# EAGLE design stlink_mount (EAGLE 8.5.0)
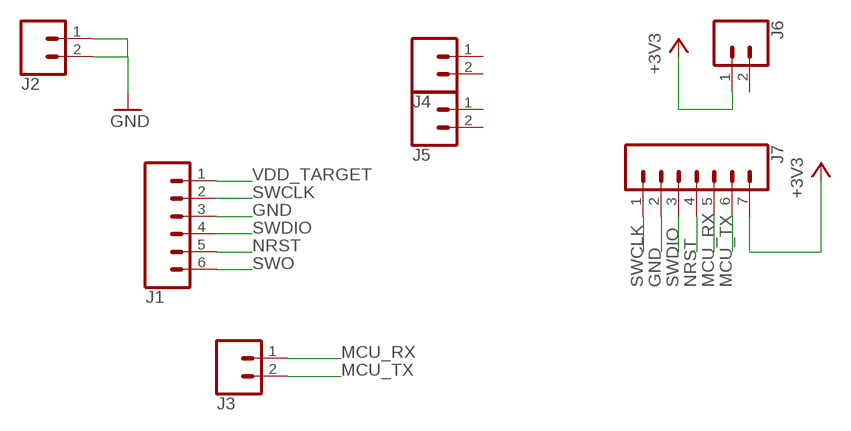
[diagram p0: schematic, sheet 1]

## Parts
J1  CONN_06SILK_FEMALE_PTH  [1X06]
J2  CONN_02  [1X02]
J3  CONN_02  [1X02]
J4  CONN_02  [1X02]
J5  CONN_02  [1X02]
J6  CONN_02  [1X02]
J7  CONN_07  [1X07]

## Nets
+3V3: J6.1 J7.7
GND: J1.3 J2.1 J2.2 J7.2
MCU_RX: J3.1 J7.5
MCU_TX: J3.2 J7.6
NRST: J1.5 J7.4
SWCLK: J1.2 J7.1
SWDIO: J1.4 J7.3
SWO: J1.6
VDD_TARGET: J1.1
Unconnected: J4.1 J4.2 J5.1 J5.2 J6.2

## Library data of the parts
J1 = SparkFun-Connectors:CONN_06: Multi connection point. Often used as Generic Header-pin footprint for 0.1 inch spaced/style header connections On any of the 0.1 inch spaced packages, you can populate with these: Break Away Headers - Straight <https://www.sparkfun.com/products/116> (PRT-00116) Break Away Male Headers - Right Angle <https://www.sparkfun.com/products/553> (PRT-00553) Female Headers <https://www.sparkfun.com/products/115> (PRT-00115) Break Away Headers - Machine Pin <https://www.sparkfun.com/products/117> (PRT-00117) Break Away Female Headers - Swiss Machine Pin <https://www.sparkfun.com/products/743> (PRT-00743) Arduino Stackable Header - 6 Pin <https://www.sparkfun.com/products/9280> (PRT-09280) For SCREWTERMINALS and SPRING TERMINALS visit here: Screw Terimnals on SparkFun.com <https://www.sparkfun.com/search/results?term=Screw+Terminals> (5mm/3.5mm/2.54mm spacing) This device is also useful as a general connection point to wire up your design to another part of your project. Our various solder wires solder well into these plated through hole pads. Hook-Up Wire - Assortment (Stranded, 22 AWG) <https://www.sparkfun.com/products/11375> (PRT-11375) Hook-Up Wire - Assortment (Solid Core, 22 AWG) <https://www.sparkfun.com/products/11367> (PRT-11367) View the entire wire category on our website here <https://www.sparkfun.com/categories/141>; PROD_ID: CONN-08437
J2-J6 = SparkFun-Connectors:CONN_02: Multi connection point. Often used as Generic Header-pin footprint for 0.1 inch spaced/style header connections On any of the 0.1 inch spaced packages, you can populate with these: Break Away Headers - Straight <https://www.sparkfun.com/products/116> (PRT-00116) Break Away Male Headers - Right Angle <https://www.sparkfun.com/products/553> (PRT-00553) Female Headers <https://www.sparkfun.com/products/115> (PRT-00115) Break Away Headers - Machine Pin <https://www.sparkfun.com/products/117> (PRT-00117) Break Away Female Headers - Swiss Machine Pin <https://www.sparkfun.com/products/743> (PRT-00743) For SCREWTERMINALS and SPRING TERMINALS visit here: Screw Terimnals on SparkFun.com <https://www.sparkfun.com/search/results?term=Screw+Terminals> (5mm/3.5mm/2.54mm spacing) This device is also useful as a general connection point to wire up your design to another part of your project. Our various solder wires solder well into these plated through hole pads. Hook-Up Wire - Assortment (Stranded, 22 AWG) <https://www.sparkfun.com/products/11375> (PRT-11375) Hook-Up Wire - Assortment (Solid Core, 22 AWG) <https://www.sparkfun.com/products/11367> (PRT-11367) View the entire wire category on our website here <https://www.sparkfun.com/categories/141> Special notes: Molex polarized connector foot print use with: PRT-08233 with associated crimp pins and housings. 2.54_SCREWTERM for use with PRT-10571. 3.5mm Screw Terminal footprints for PRT-08084 5mm Screw Terminal footprints for use with PRT-08432
J7 = SparkFun-Connectors:CONN_07: Multi connection point. Often used as Generic Header-pin footprint for 0.1 inch spaced/style header connections On any of the 0.1 inch spaced packages, you can populate with these: Break Away Headers - Straight <https://www.sparkfun.com/products/116> (PRT-00116) Break Away Male Headers - Right Angle <https://www.sparkfun.com/products/553> (PRT-00553) Female Headers <https://www.sparkfun.com/products/115> (PRT-00115) Break Away Headers - Machine Pin <https://www.sparkfun.com/products/117> (PRT-00117) Break Away Female Headers - Swiss Machine Pin <https://www.sparkfun.com/products/743> (PRT-00743) For SCREWTERMINALS and SPRING TERMINALS visit here: Screw Terimnals on SparkFun.com <https://www.sparkfun.com/search/results?term=Screw+Terminals> (5mm/3.5mm/2.54mm spacing) This device is also useful as a general connection point to wire up your design to another part of your project. Our various solder wires solder well into these plated through hole pads. Hook-Up Wire - Assortment (Stranded, 22 AWG) <https://www.sparkfun.com/products/11375> (PRT-11375) Hook-Up Wire - Assortment (Solid Core, 22 AWG) <https://www.sparkfun.com/products/11367> (PRT-11367) View the entire wire category on our website here <https://www.sparkfun.com/categories/141> Special notes: Molex polarized connector foot print use with SKU : PRT-08231 with associated crimp pins and housings. 1MM SMD Version SKU: PRT-10208 NOTES ON THE VARIANTS LOCK and LOCK_LONGPADS... This footprint was designed to help hold the alignment of a through-hole component (i.e. 6-pin header) while soldering it into place. You may notice that each hole has been shifted either up or down by 0.005 of an inch from it's more standard position (which is a perfectly straight line). This slight alteration caused the pins (the squares in the middle) to touch the edges of the holes. Because they are alternating, it causes a "brace" to hold the component in place. 0.005 has proven to be the perfect amount of "off-center" position when using our standard breakaway headers. Although looks a little odd when you look at the bare footprint, once you have a header in there, the alteration is very hard to notice. Also,if you push a header all the way into place, it is covered up entirely on the bottom side.

## Board
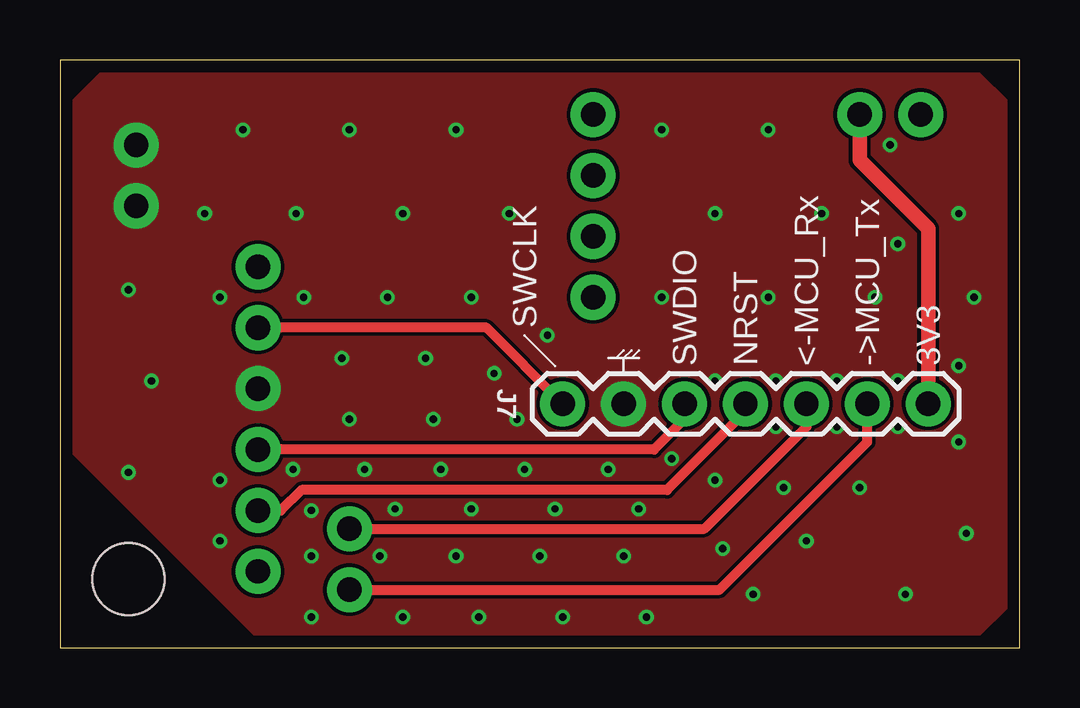
[diagram p1: board, top side]
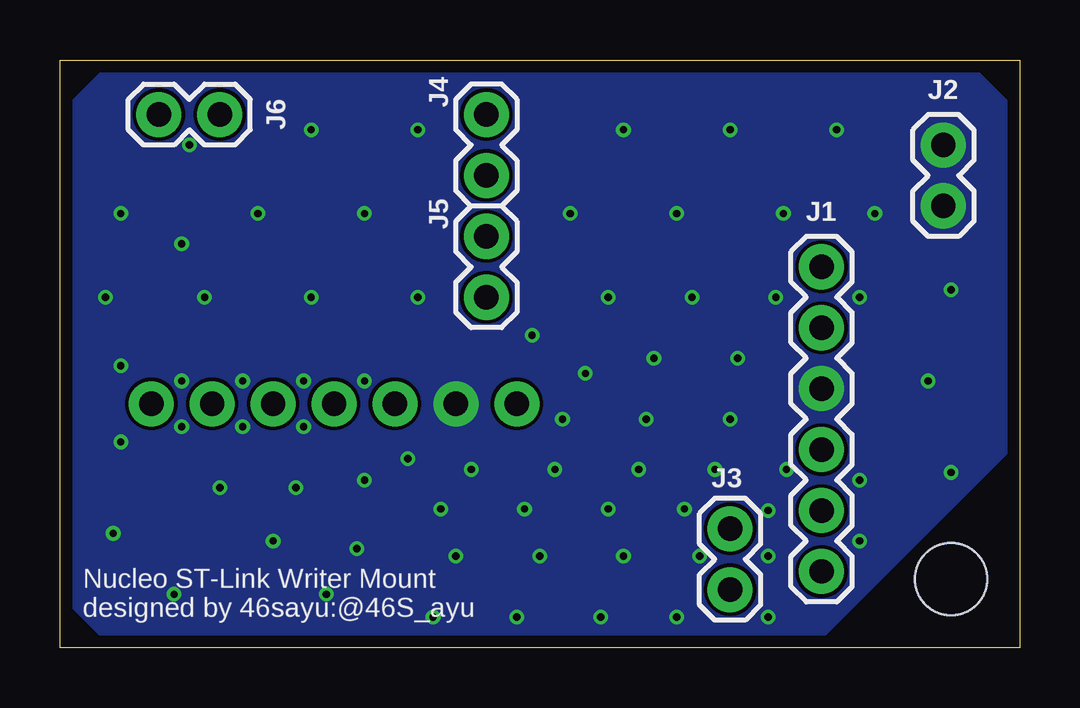
[diagram p2: board, bottom side, seen from below]

Size 40 x 24.5 mm. Coordinates in mm from the lower left corner, seen from the top.
Outline: 0,0 40,0 40,24.5 0,24.5 0,0
Copper layers (1*16): Top 0.035mm / dielectric 1.6mm / Bottom 0.035mm
Design rules "Elecrow_2-layer_PCB_eagle_rule": minimum track width 6mil, minimum drill 12mil, track to track 6mil, track to pad 6mil, pad to pad 6mil, via to via 8mil, smd to smd 0mil, copper to edge 20mil, drill to drill 10mil, minimum pad ring 6mil, minimum via ring 6mil, stop-mask expansion 0mil, vias tented up to drill 100mil, thermal gap 10mil
Holes 3 mm at 2.86,2.86

### Footprints (pad centres in the part's own frame; a part is rotated, then mirrored left to right if it is on the bottom)
1X06 = drill 1.016 pad 1.88: 1 0,0; 2 2.54,0; 3 5.08,0; 4 7.62,0; 5 10.16,0; 6 12.7,0
1X02 = drill 1.016 pad 1.88: 1 0,0; 2 2.54,0
1X07 = drill 1.016 pad 1.88: 1 0,0; 2 2.54,0; 3 5.08,0; 4 7.62,0; 5 10.16,0; 6 12.7,0; 7 15.24,0

### Placement (x,y rotation side)
J1  8.26,15.88 270 bottom
J2  3.17,20.95 270 bottom
J3  12.06,4.95 270 bottom
J4  22.23,22.23 270 bottom
J5  22.23,17.14 270 bottom
J6  33.34,22.23 180 bottom
J7  20.95,10.16 0 top

### Tracks (layer width: path | path; a pad name or v marks a point on that pad's centre or on a via)
+3V3
  Top 0.61: J7.7 36.2,17.46 33.34,20.32 J6.1
GND  (via drill 0.3, 0.3 pad 0.61)
  other vias: 25.5,7.87 27.3,11.11 13.34,3.81 16.51,3.81 9.72,7.43 10.48,5.71 13.97,5.78 17.14,5.78 20.64,5.78 20,3.81 24.13,5.78 23.5,3.81 20.95,1.27 17.46,1.27 14.29,1.27 24.45,1.27 28.89,2.22 31.11,4.45 27.62,4.13 30.16,6.67 27.3,6.99 29.84,9.21 32.38,9.21 34.92,9.21 33.34,6.67 35.24,2.22 37.78,4.76 37.47,8.57 34.92,11.11 32.38,11.11 29.84,11.11 12.7,7.43 15.88,7.43 19.37,7.43 22.86,7.43 12.06,9.53 15.56,9.53 19.05,9.53 18.1,11.43 20.32,13.02 17.14,14.61 13.65,14.61 10.16,14.61 11.75,12.06 15.24,12.06 3.81,11.11 2.86,7.3 2.86,14.92 6.67,14.61 6.67,6.99 6.67,4.45 9.84,18.1 6.03,18.1 7.62,21.59 12.06,21.59 16.51,21.59 14.29,18.1 18.73,18.1 25.08,21.59 27.3,18.1 25.08,14.61 29.53,14.61 31.75,18.1 34.92,16.83 33.97,14.61 38.1,14.61 37.47,11.75 37.47,18.1 34.61,20.95 29.53,21.59 10.48,1.27 10.48,3.81
  pour Bottom (no thermals): 1.91,24.13 38.1,24.13 39.69,22.54 39.69,1.91 38.1,0.32 8.35,0.32 0.32,8.35 0.32,22.54
  pour Top (no thermals): 38.1,24.13 39.69,22.54 39.69,1.91 38.1,0.32 8.35,0.32 0.32,8.35 0.32,22.54 1.91,24.13
MCU_RX
  Top 0.406: J3.1 26.86,4.95 31.11,9.21 J7.5
MCU_TX
  Top 0.406: J3.2 27.5,2.41 33.66,8.57 J7.6
NRST
  Top 0.406: J7.4 28.57,9.84 25.3,6.57 10.06,6.57 9.21,5.71 J1.5
SWCLK
  Top 0.406: J7.1 17.78,13.34 J1.2
SWDIO
  Top 0.406: J7.3 26.04,9.53 24.77,8.26 J1.4

### Text on the board
tPlace: SWCLK | SWDIO | NRST | <-MCU_Rx | ->MCU_Tx | 3V3
bPlace: Nucleo ST-Link Writer Mount / designed by 46sayu:@46S_ayu